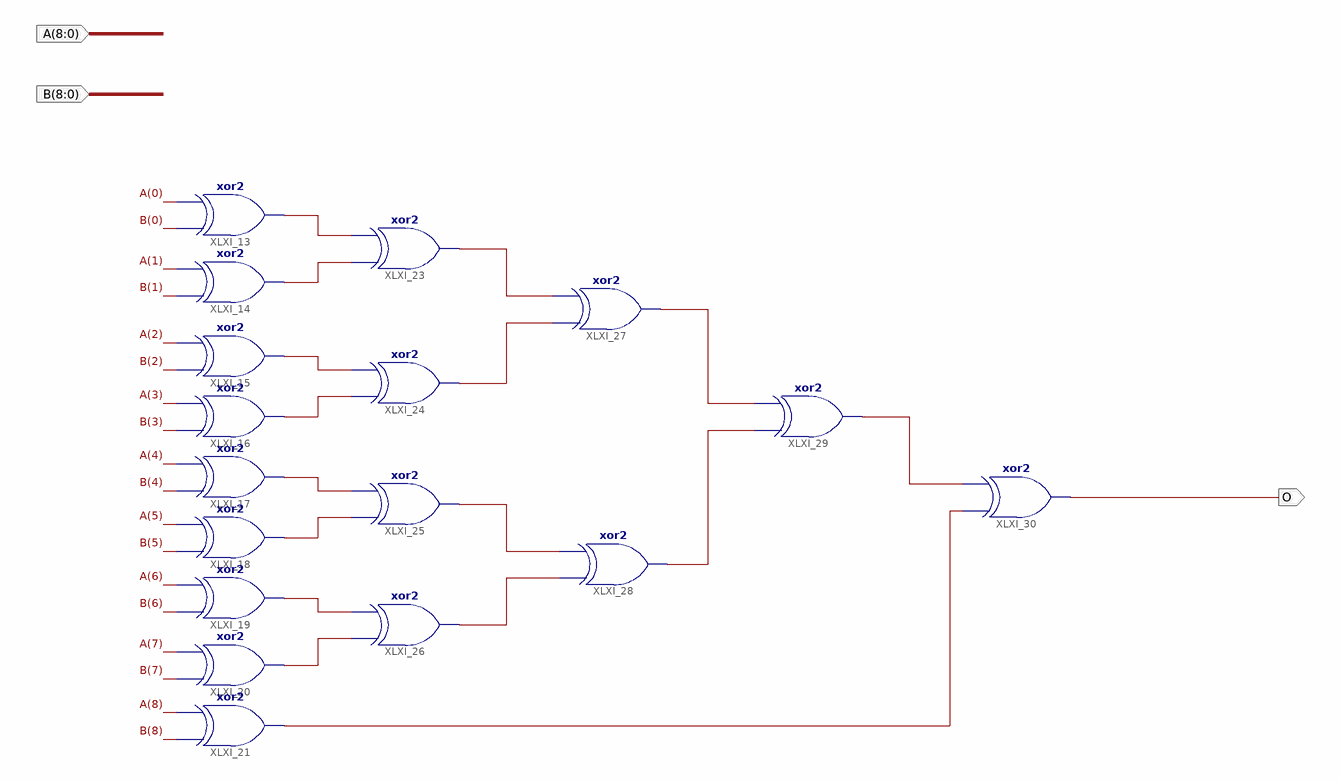
[diagram p0: schematic sheet 1]
// Xilinx ISE schematic Color.sch (spartan6) as structural Verilog: 17 symbols, 3 ports
module Color (
  input  [8:0] A,
  input  [8:0] B,
  output O
);

  wire XLXN_44, XLXN_45, XLXN_46, XLXN_47, XLXN_48, XLXN_49, XLXN_50, XLXN_51, XLXN_52, XLXN_53, XLXN_54,
       XLXN_55, XLXN_56, XLXN_57, XLXN_58, XLXN_59;

  xor XLXI_13 (XLXN_44, B[0], A[0]);
  xor XLXI_14 (XLXN_45, B[1], A[1]);
  xor XLXI_15 (XLXN_46, B[2], A[2]);
  xor XLXI_16 (XLXN_47, B[3], A[3]);
  xor XLXI_17 (XLXN_48, B[4], A[4]);
  xor XLXI_18 (XLXN_49, B[5], A[5]);
  xor XLXI_19 (XLXN_50, B[6], A[6]);
  xor XLXI_20 (XLXN_51, B[7], A[7]);
  xor XLXI_21 (XLXN_59, B[8], A[8]);
  xor XLXI_23 (XLXN_52, XLXN_45, XLXN_44);
  xor XLXI_24 (XLXN_53, XLXN_47, XLXN_46);
  xor XLXI_25 (XLXN_54, XLXN_49, XLXN_48);
  xor XLXI_26 (XLXN_55, XLXN_51, XLXN_50);
  xor XLXI_27 (XLXN_56, XLXN_53, XLXN_52);
  xor XLXI_28 (XLXN_57, XLXN_55, XLXN_54);
  xor XLXI_29 (XLXN_58, XLXN_57, XLXN_56);
  xor XLXI_30 (O, XLXN_59, XLXN_58);
endmodule
